# EAGLE schematic A (EAGLE 7.3.0)
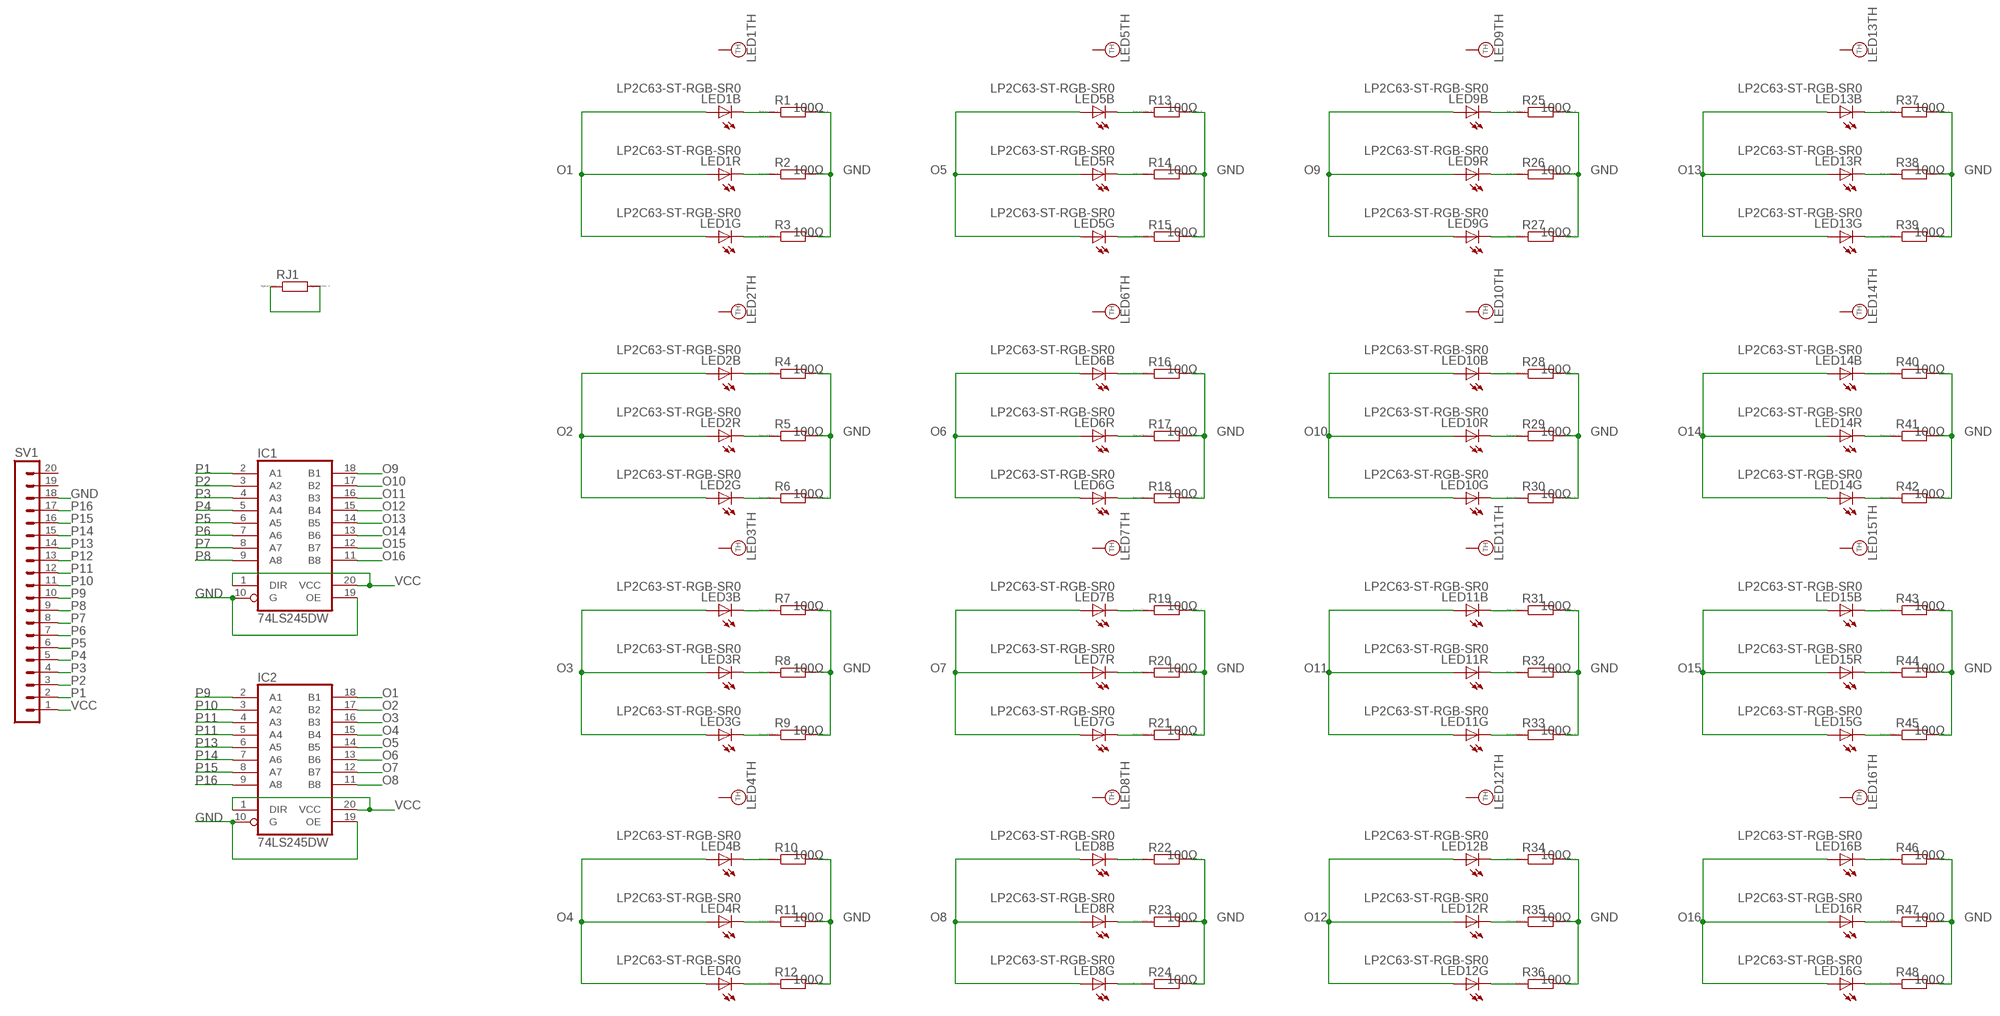
[diagram p0: schematic, sheet 1]

## Parts
IC1  74LS245DW  [SO20W]
IC2  74LS245DW  [SO20W]
LED1  LP2C63-ST-RGB-SR0  [LP2C63-ST-RGB-SR0]
LED2  LP2C63-ST-RGB-SR0  [LP2C63-ST-RGB-SR0]
LED3  LP2C63-ST-RGB-SR0  [LP2C63-ST-RGB-SR0]
LED4  LP2C63-ST-RGB-SR0  [LP2C63-ST-RGB-SR0]
LED5  LP2C63-ST-RGB-SR0  [LP2C63-ST-RGB-SR0]
LED6  LP2C63-ST-RGB-SR0  [LP2C63-ST-RGB-SR0]
LED7  LP2C63-ST-RGB-SR0  [LP2C63-ST-RGB-SR0]
LED8  LP2C63-ST-RGB-SR0  [LP2C63-ST-RGB-SR0]
LED9  LP2C63-ST-RGB-SR0  [LP2C63-ST-RGB-SR0]
LED10  LP2C63-ST-RGB-SR0  [LP2C63-ST-RGB-SR0]
LED11  LP2C63-ST-RGB-SR0  [LP2C63-ST-RGB-SR0]
LED12  LP2C63-ST-RGB-SR0  [LP2C63-ST-RGB-SR0]
LED13  LP2C63-ST-RGB-SR0  [LP2C63-ST-RGB-SR0]
LED14  LP2C63-ST-RGB-SR0  [LP2C63-ST-RGB-SR0]
LED15  LP2C63-ST-RGB-SR0  [LP2C63-ST-RGB-SR0]
LED16  LP2C63-ST-RGB-SR0  [LP2C63-ST-RGB-SR0]
R1  RR0603  [R0603]
R2  RR0603  [R0603]
R3  RR0603  [R0603]
R4  RR0603  [R0603]
R5  RR0603  [R0603]
R6  RR0603  [R0603]
R7  RR0603  [R0603]
R8  RR0603  [R0603]
R9  RR0603  [R0603]
R10  RR0603  [R0603]
R11  RR0603  [R0603]
R12  RR0603  [R0603]
R13  RR0603  [R0603]
R14  RR0603  [R0603]
R15  RR0603  [R0603]
R16  RR0603  [R0603]
R17  RR0603  [R0603]
R18  RR0603  [R0603]
R19  RR0603  [R0603]
R20  RR0603  [R0603]
R21  RR0603  [R0603]
R22  RR0603  [R0603]
R23  RR0603  [R0603]
R24  RR0603  [R0603]
R25  RR0603  [R0603]
R26  RR0603  [R0603]
R27  RR0603  [R0603]
R28  RR0603  [R0603]
R29  RR0603  [R0603]
R30  RR0603  [R0603]
R31  RR0603  [R0603]
R32  RR0603  [R0603]
R33  RR0603  [R0603]
R34  RR0603  [R0603]
R35  RR0603  [R0603]
R36  RR0603  [R0603]
R37  RR0603  [R0603]
R38  RR0603  [R0603]
R39  RR0603  [R0603]
R40  RR0603  [R0603]
R41  RR0603  [R0603]
R42  RR0603  [R0603]
R43  RR0603  [R0603]
R44  RR0603  [R0603]
R45  RR0603  [R0603]
R46  RR0603  [R0603]
R47  RR0603  [R0603]
R48  RR0603  [R0603]
RJ1  R  [R0805]
SV1  MA20-1  [MA20-1]

## Nets
GND: IC1.10(G) IC1.19(OE) IC2.10(G) IC2.19(OE) R1.2 R2.2 R3.2 R4.2 R5.2 R6.2 R7.2 R8.2 R9.2 R10.2 R11.2 R12.2 R13.2 R14.2 R15.2 R16.2 R17.2 R18.2 R19.2 R20.2 R21.2 R22.2 R23.2 R24.2 R25.2 R26.2 R27.2 R28.2 R29.2 R30.2 R31.2 R32.2 R33.2 R34.2 R35.2 R36.2 R37.2 R38.2 R39.2 R40.2 R41.2 R42.2 R43.2 R44.2 R45.2 R46.2 R47.2 R48.2 RJ1.1 RJ1.2 SV1.18
N$1: LED1.4(B:C) R1.1
N$2: LED1.5(R:C) R2.1
N$3: LED1.6(G:C) R3.1
N$4: LED2.4(B:C) R4.1
N$5: LED2.5(R:C) R5.1
N$6: LED2.6(G:C) R6.1
N$7: LED3.4(B:C) R7.1
N$8: LED3.5(R:C) R8.1
N$9: LED3.6(G:C) R9.1
N$10: LED4.4(B:C) R10.1
N$11: LED4.5(R:C) R11.1
N$12: LED4.6(G:C) R12.1
N$13: LED5.4(B:C) R13.1
N$14: LED5.5(R:C) R14.1
N$15: LED5.6(G:C) R15.1
N$16: LED6.4(B:C) R16.1
N$17: LED6.5(R:C) R17.1
N$18: LED6.6(G:C) R18.1
N$19: LED7.4(B:C) R19.1
N$20: LED7.5(R:C) R20.1
N$21: LED7.6(G:C) R21.1
N$22: LED8.4(B:C) R22.1
N$23: LED8.5(R:C) R23.1
N$24: LED8.6(G:C) R24.1
N$25: LED9.4(B:C) R25.1
N$26: LED9.5(R:C) R26.1
N$27: LED9.6(G:C) R27.1
N$28: LED10.4(B:C) R28.1
N$29: LED10.5(R:C) R29.1
N$30: LED10.6(G:C) R30.1
N$31: LED11.4(B:C) R31.1
N$32: LED11.5(R:C) R32.1
N$33: LED11.6(G:C) R33.1
N$34: LED12.4(B:C) R34.1
N$35: LED12.5(R:C) R35.1
N$36: LED12.6(G:C) R36.1
N$37: LED13.4(B:C) R37.1
N$38: LED13.5(R:C) R38.1
N$39: LED13.6(G:C) R39.1
N$40: LED14.4(B:C) R40.1
N$41: LED14.5(R:C) R41.1
N$42: LED14.6(G:C) R42.1
N$43: LED15.4(B:C) R43.1
N$44: LED15.5(R:C) R44.1
N$45: LED15.6(G:C) R45.1
N$46: LED16.4(B:C) R46.1
N$47: LED16.5(R:C) R47.1
N$48: LED16.6(G:C) R48.1
O1: IC2.18(B1) LED1.1(G:A) LED1.2(R:A) LED1.3(B:A)
O2: IC2.17(B2) LED2.1(G:A) LED2.2(R:A) LED2.3(B:A)
O3: IC2.16(B3) LED3.1(G:A) LED3.2(R:A) LED3.3(B:A)
O4: IC2.15(B4) LED4.1(G:A) LED4.2(R:A) LED4.3(B:A)
O5: IC2.14(B5) LED5.1(G:A) LED5.2(R:A) LED5.3(B:A)
O6: IC2.13(B6) LED6.1(G:A) LED6.2(R:A) LED6.3(B:A)
O7: IC2.12(B7) LED7.1(G:A) LED7.2(R:A) LED7.3(B:A)
O8: IC2.11(B8) LED8.1(G:A) LED8.2(R:A) LED8.3(B:A)
O9: IC1.18(B1) LED9.1(G:A) LED9.2(R:A) LED9.3(B:A)
O10: IC1.17(B2) LED10.1(G:A) LED10.2(R:A) LED10.3(B:A)
O11: IC1.16(B3) LED11.1(G:A) LED11.2(R:A) LED11.3(B:A)
O12: IC1.15(B4) LED12.1(G:A) LED12.2(R:A) LED12.3(B:A)
O13: IC1.14(B5) LED13.1(G:A) LED13.2(R:A) LED13.3(B:A)
O14: IC1.13(B6) LED14.1(G:A) LED14.2(R:A) LED14.3(B:A)
O15: IC1.12(B7) LED15.1(G:A) LED15.2(R:A) LED15.3(B:A)
O16: IC1.11(B8) LED16.1(G:A) LED16.2(R:A) LED16.3(B:A)
P1: IC1.2(A1) SV1.2
P2: IC1.3(A2) SV1.3
P3: IC1.4(A3) SV1.4
P4: IC1.5(A4) SV1.5
P5: IC1.6(A5) SV1.6
P6: IC1.7(A6) SV1.7
P7: IC1.8(A7) SV1.8
P8: IC1.9(A8) SV1.9
P9: IC2.2(A1) SV1.10
P10: IC2.3(A2) SV1.11
P11: IC2.4(A3) SV1.12
P12: IC2.5(A4) SV1.13
P13: IC2.6(A5) SV1.14
P14: IC2.7(A6) SV1.15
P15: IC2.8(A7) SV1.16
P16: IC2.9(A8) SV1.17
VCC: IC1.1(DIR) IC1.20(VCC) IC2.1(DIR) IC2.20(VCC) SV1.1
Unconnected: LED1.TH(TH:TH) LED2.TH(TH:TH) LED3.TH(TH:TH) LED4.TH(TH:TH) LED5.TH(TH:TH) LED6.TH(TH:TH) LED7.TH(TH:TH) LED8.TH(TH:TH) LED9.TH(TH:TH) LED10.TH(TH:TH) LED11.TH(TH:TH) LED12.TH(TH:TH) LED13.TH(TH:TH) LED14.TH(TH:TH) LED15.TH(TH:TH) LED16.TH(TH:TH) SV1.19 SV1.20

## Library data of the parts
IC1 IC2 = 74xx-us:74*245: Octal BUS TRANSCEIVER, 3-state
LED1-LED16 = led:LP2C63-ST-RGB-SR0: 1.5W RGB HIGH POWER LED Source: http://www.ledtech.com.tw .. LP2C63-ST-RGB-SR0.SPEC.pdf
R1-R48 = eagle-ltspice:R: RESISTOR, European symbol; SPICEMODEL: 100Ω; SPICEPREFIX: R
RJ1 = eagle-ltspice:R: RESISTOR, European symbol; SPICEMODEL: NONE; SPICEPREFIX: R
SV1 = con-lstb:MA20-1: PIN HEADER; OC_FARNELL: unknown; OC_NEWARK: unknown